# EAGLE design NanoV3.3 (EAGLE 9.2.2)
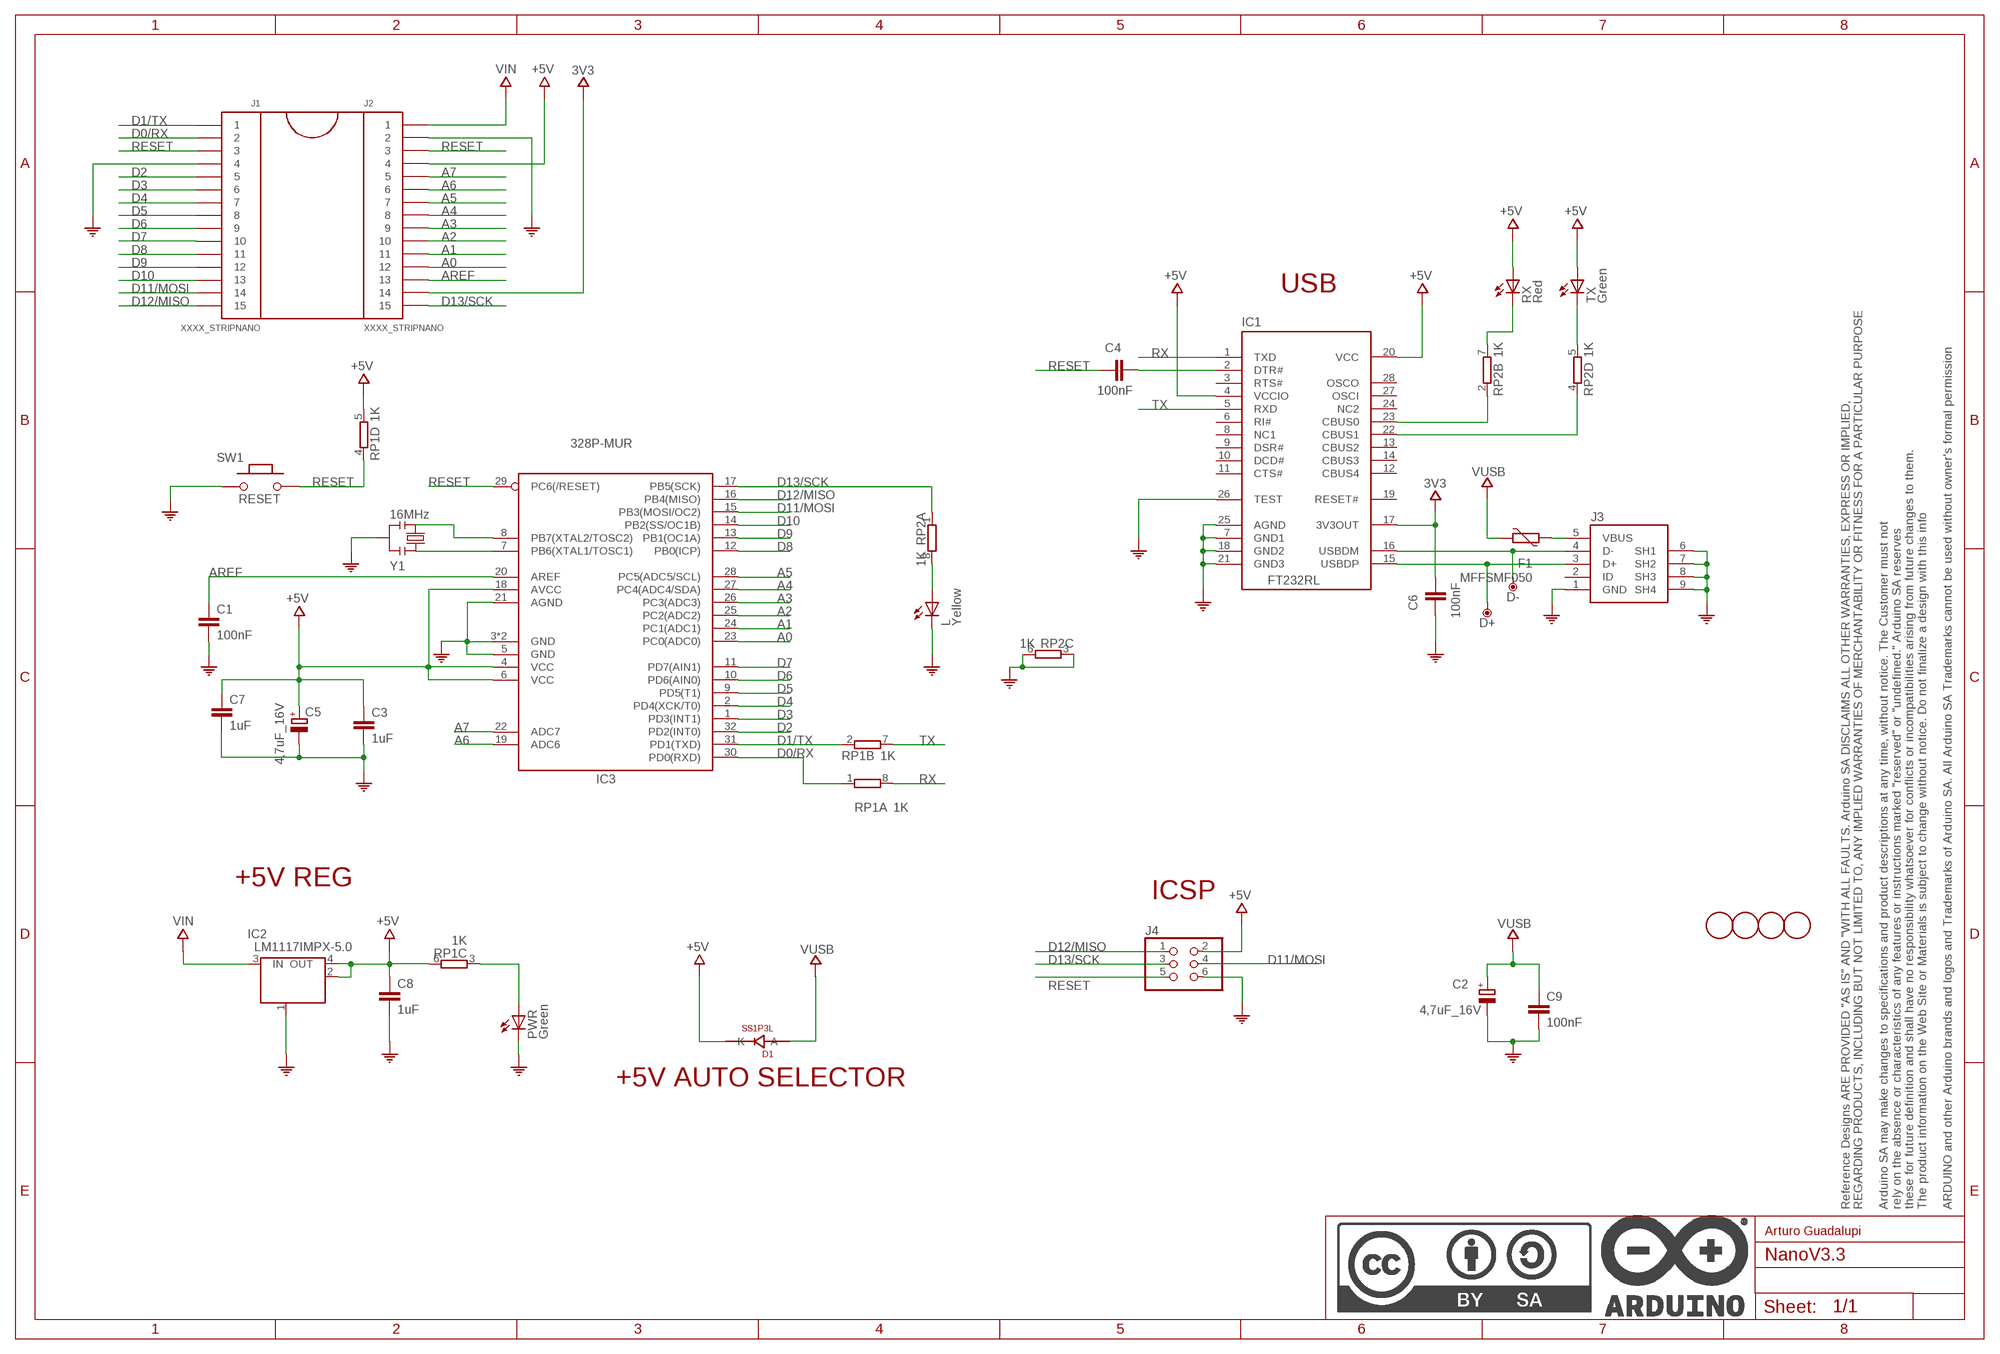
[diagram p0: schematic, sheet 1]

## Parts
C1  100nF  0015_100NF_0603  [C0603-ROUND]
C2  4,7uF_16V  0833_TAJA475MO16RNJ  [TAN-A]
C3  1uF  0006_1UF_0603/GRM188R61E105KA12D  [C0603-ROUND]
C4  100nF  0015_100NF_0603  [C0603-ROUND]
C5  4,7uF_16V  0833_TAJA475MO16RNJ  [TAN-A]
C6  100nF  0015_100NF_0603  [C0603-ROUND]
C7  1uF  0006_1UF_0603/GRM188R61E105KA12D  [C0603-ROUND]
C8  1uF  0006_1UF_0603/GRM188R61E105KA12D  [C0603-ROUND]
C9  100nF  0015_100NF_0603  [C0603-ROUND]
D1  SS1P3L  0025_SS1P3L-M3/84A  [DO220AAL]
D+  DNP  TPTP-1.00MM  [TP-1.00MM]
D-  DNP  TPTP-1.00MM  [TP-1.00MM]
F1  MFFSMF050  PTC  [0603-1608X90N]
FRAME1  DNP  A3-FRAME  [FRAME]
IC1  FT232RL  0226_FT232RL  [SSOP28]
IC2  LM1117IMPX-5.0  0022_LM1117IMPX-5.0  [LINEAR_SOT223]
IC3  328P-MUR  ATMEGA328P-32MUR  [VQFN32]
J1  XXXX_STRIPNANO  [HEAD15-NOSS]
J2  XXXX_STRIPNANO  [HEAD15-NOSS]
J3  0219_14850  [USB-MINI-B_2]
J4  0114_PH254-203DF118A00V  [2X03]
L  Yellow  0044_KPT-2012YC  [CHIPLED_0805]
PWR  Green  0043_KPT-2012SGC  [CHIPLED_0805]
RP1  1K  0005_064R_1K_/_CAY16-102J4LF  [CAY16]
RP2  1K  0005_064R_1K_/_CAY16-102J4LF  [CAY16]
RX  Red  0181_KTP-2012SURCK  [CHIPLED_0805]
SW1  RESET  0173_IT-1185AP1C-160G-G_T&R  [SMD_157SW]
TX  Green  0043_KPT-2012SGC  [CHIPLED_0805]
U$4  DNP  FIDUCIAL-1.5MM  [FD-1-1.5]
U$5  DNP  FIDUCIAL-1.5MM  [FD-1-1.5]
U$53  DNP  FIDUCIAL-1.5MM  [FD-1-1.5]
U$54  DNP  FIDUCIAL-1.5MM  [FD-1-1.5]
Y1  16MHz  0011_CSTCE16M0V53-R0  [RESONATOR]

## Nets
3V3: C6.2 IC1.17(3V3OUT) J2.14
+5V: C3.1 C5.1(+) C7.1 C8.1 D1.P$1(K) IC1.4(VCCIO) IC1.20(VCC) IC2.2(OUT) IC2.4(OUT) IC3.4(VCC) IC3.6(VCC) IC3.18(AVCC) J2.4 J4.2 RP1.5 RP1.6 RX.A TX.A
A0: IC3.23(PC0(ADC0)) J2.12
A1: IC3.24(PC1(ADC1)) J2.11
A2: IC3.25(PC2(ADC2)) J2.10
A3: IC3.26(PC3(ADC3)) J2.9
A4: IC3.27(PC4(ADC4/SDA)) J2.8
A5: IC3.28(PC5(ADC5/SCL)) J2.7
A6: IC3.19(ADC6) J2.6
A7: IC3.22(ADC7) J2.5
AREF: C1.1 IC3.20(AREF) J2.13
COM: C1.2 C2.2(-) C3.2 C5.2(-) C6.1 C7.2 C8.2 C9.2 IC1.7(GND1) IC1.18(GND2) IC1.21(GND3) IC1.25(AGND) IC1.26(TEST) IC2.1(GND/ADJ) IC3.3(GND) IC3.5(GND) IC3.21(AGND) IC3.33(GND) J1.4 J2.2 J3.1(GND) J3.6(SH1) J3.7(SH2) J3.8(SH3) J3.9(SH4) J4.6 L.C PWR.C RP2.3 RP2.6 SW1.1 Y1.2
D0/RX: IC3.30(PD0(RXD)) J1.2 RP1.1
D1/TX: IC3.31(PD1(TXD)) J1.1 RP1.2
D2: IC3.32(PD2(INT0)) J1.5
D3: IC3.1(PD3(INT1)) J1.6
D4: IC3.2(PD4(XCK/T0)) J1.7
D5: IC3.9(PD5(T1)) J1.8
D6: IC3.10(PD6(AIN0)) J1.9
D7: IC3.11(PD7(AIN1)) J1.10
D8: IC3.12(PB0(ICP)) J1.11
D9: IC3.13(PB1(OC1A)) J1.12
D10: IC3.14(PB2(SS/OC1B)) J1.13
D11/MOSI: IC3.15(PB3(MOSI/OC2)) J1.14 J4.4
D12/MISO: IC3.16(PB4(MISO)) J1.15 J4.1
D13/SCK: IC3.17(PB5(SCK)) J2.15 J4.3 RP2.1
N$1: IC3.8(PB7(XTAL2/TOSC2)) Y1.3
N$2: IC3.7(PB6(XTAL1/TOSC1)) Y1.1
N$3: PWR.A RP1.3
N$4: C4.2 IC1.2(DTR#)
N$5: D+.X IC1.15(USBDP) J3.3(D+)
N$6: D-.X IC1.16(USBDM) J3.4(D-)
N$7: L.A RP2.8
N$8: IC1.23(CBUS0) RP2.2
N$9: IC1.22(CBUS1) RP2.4
N$11: RP2.5 TX.C
N$26: F1.2 J3.5(VBUS)
N$29: RP2.7 RX.C
RESET: C4.1 IC3.29(PC6(/RESET)) J1.3 J2.3 J4.5 RP1.4 SW1.2
RX: IC1.1(TXD) RP1.8
TX: IC1.5(RXD) RP1.7
VIN: IC2.3(IN) J2.1
VUSB: C2.1(+) C9.1 D1.P$2(A) F1.1
Unconnected: IC1.3(RTS#) IC1.6(RI#) IC1.8(NC1) IC1.9(DSR#) IC1.10(DCD#) IC1.11(CTS#) IC1.12(CBUS4) IC1.13(CBUS2) IC1.14(CBUS3) IC1.19(RESET#) IC1.24(NC2) IC1.27(OSCI) IC1.28(OSCO) J3.2(ID)

## Notes on the sheet
- USB
- +5V REG
- ICSP
- +5V AUTO SELECTOR
- Arturo Guadalupi

## Library data of the parts
C1 C4 C6 C9 = Condensatori:0015_100NF_0603: 100nF 0603 50V; CASE: 0603; MONTHLY_USAGE: _____; PART_NUMBER: cl10b104kbnc; PRICE: _____; SUPPLIER: _____; TYPE: Condensatori
C2 C5 = Condensatori:0833_TAJA475MO16RNJ: 4,7uF; CASE: Case_A_(1206); MONTHLY_USAGE: _____; PART_NUMBER: TAJA475MO16RNJ; PRICE: _____; SUPPLIER: _____; TYPE: Condensatori
C3 C7 C8 = Condensatori:0006_1UF_0603/GRM188R61E105KA12D: 1uF 0603; CASE: 0603; MONTHLY_USAGE: _____; PART_NUMBER: 1uF_0603/GRM188R61E105KA12D; PRICE: _____; SUPPLIER: _____; TYPE: Condensatori
D1 = Diodi:0025_SS1P3L-M3/84A: 1A 30V Schottky Barrier Rectifiers -SS1P3L-M3/84A; CASE: SMP; MONTHLY_USAGE: _____; PART_NUMBER: SS1P3L-M3/84A; PRICE: _____; SUPPLIER: _____; TYPE: Diodi
D+ D- = Arduino-utility:TP: Testpoint; DATASHEET: DNP; DISTRIBUTOR-LINK: DNP; DISTRIBUTOR-PN: DNP; MANUFACTURER: DNP; MANUFACTURER-PN: DNP
F1 = Arduino-rcl:PTC: SMD PTC; DATASHEET: http://www.bourns.com/docs/Product-Datasheets/mffsmf.pdf; DISTRIBUTOR-LINK: http://www.digikey.com/product-detail/en/bourns-inc/MF-FSMF050X-2/MF-FSMF050X-2CT-ND/2039389; DISTRIBUTOR-PN: MF-FSMF050X-2CT-ND; MANUFACTURER: Bourns Inc; MANUFACTURER-PN: MF-FSMF050X-2
FRAME1 = Arduino-utility:A3-FRAME; CODE-ARDUINO: DNP; DATASHEET: DNP; DISTRIBUTOR-LINK: DNP; DISTRIBUTOR-PN: DNP; MANUFACTURER: DNP; MANUFACTURER-PN: DNP; NOTE: DNP
IC1 = IntegratedCircuits:0226_FT232RL: USB to serial UART interface -FT232RL; CASE: SSOP28; MONTHLY_USAGE: _____; PART_NUMBER: FT232RL; PRICE: _____; SUPPLIER: _____; TYPE: Circuito_Integrato
IC2 = IntegratedCircuits:0022_LM1117IMPX-5.0: Low-dropout linear regulator 5V -LM1117IMPX-5.0; CASE: SOT223; MONTHLY_USAGE: _____; PART_NUMBER: LM1117IMPX-5.0; PRICE: _____; SUPPLIER: _____; TYPE: Circuito_Integrato
IC3 = Arduino-ucs&SoCs:ATMEGA328P-32: 8-bit Microcontroller with 32KBytes In-System Programmable Flash ATMEGA328P-AU; DATASHEET: http://www.atmel.com/images/Atmel-8271-8-bit-AVR-Microcontroller-ATmega48A-48PA-88A-88PA-168A-168PA-328-328P_datasheet_Complete.pdf; DISTRIBUTOR-LINK: https://www.digikey.it/product-detail/it/microchip-technology/ATMEGA328P-MUR/ATMEGA328P-MURCT-ND/3440953; DISTRIBUTOR-PN: ATMEGA328P-MURCT-ND; MANUFACTURER: ATMEL; MANUFACTURER-PN: ATMEGA328P-MUR
J1 J2 = Connettori:XXXX_STRIPNANO: Strip passo 2,54 a 15 pin per Arduino Nano; VALUE: Strip15pin
J3 = Connettori:0219_14850: Usb-Mini F 90 Smd; MONTHLY_USAGE: _____; PART_NUMBER: 14850; PRICE: _____; SUPPLIER: _____; TYPE: Connettori; VALUE: USB-mini-90 -SMD
J4 = Connettori:0114_PH254-203DF118A00V: 3x2 M V h 8,5 mm p2,54; MONTHLY_USAGE: _____; PART_NUMBER: PH254-203DF118A00V; PRICE: _____; SUPPLIER: _____; TYPE: Connettori; VALUE: ICSP
L = Opto:0044_KPT-2012YC: LED YELLOW - SMD - 0805; MONTHLY_USAGE: _____; PART_NUMBER: KPT-2012YC; PRICE: _____; SUPPLIER: _____; TYPE: Opto
PWR TX = Opto:0043_KPT-2012SGC: LED GREEN - SMD-0805; MONTHLY_USAGE: _____; PART_NUMBER: KPT-2012SGC; PRICE: _____; SUPPLIER: _____; TYPE: Opto
RP1 RP2 = Resistenze:0005_064R_1K_/_CAY16-102J4LF: 1K 064R; CASE: SMD_3,2x1,6; MONTHLY_USAGE: _____; PART_NUMBER: 064R_1K_/_CAY16-102J4LF; PRICE: _____; SUPPLIER: _____; TYPE: Resistenze
RX = Opto:0181_KTP-2012SURCK: LED RED - SMD - 0805; MONTHLY_USAGE: _____; PART_NUMBER: KTP-2012SURCK; PRICE: _____; SUPPLIER: _____; TYPE: Opto
SW1 = Switches:0173_IT-1185AP1C-160G-G_T&R: Pushbutton 4x3 SMD H2,5mm; MONTHLY_USAGE: _____; PART_NUMBER: IT-1185AP1C-160G-G_T&R; PRICE: _____; SUPPLIER: _____; TYPE: Switches; VALUE: 157SW
U$4 U$5 U$53 U$54 = Arduino-utility:FIDUCIAL: Fiducial mount; DATASHEET: DNP; DISTRIBUTOR-LINK: DNP; DISTRIBUTOR-PN: DNP; MANUFACTURER: DNP; MANUFACTURER-PN: DNP
Y1 = Cristalli:0011_CSTCE16M0V53-R0: 16Mhz - SMD; MONTHLY_USAGE: _____; PART_NUMBER: CSTCE16M0V53-R0; PRICE: _____; SUPPLIER: _____; TYPE: Cristalli; VALUE: CSTCE16M0V53-R0

## Board
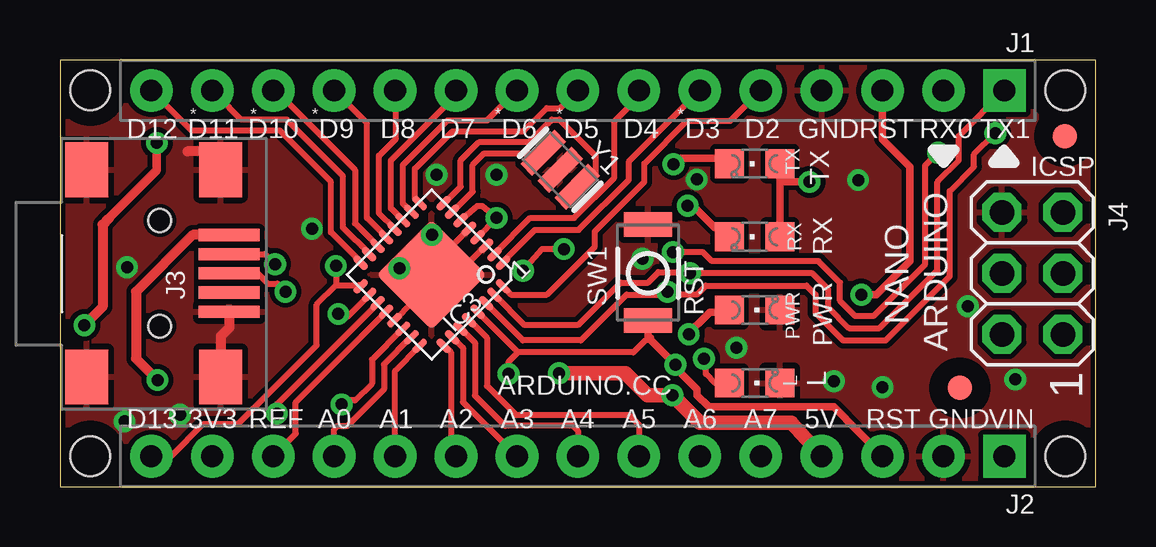
[diagram p1: board, top side]
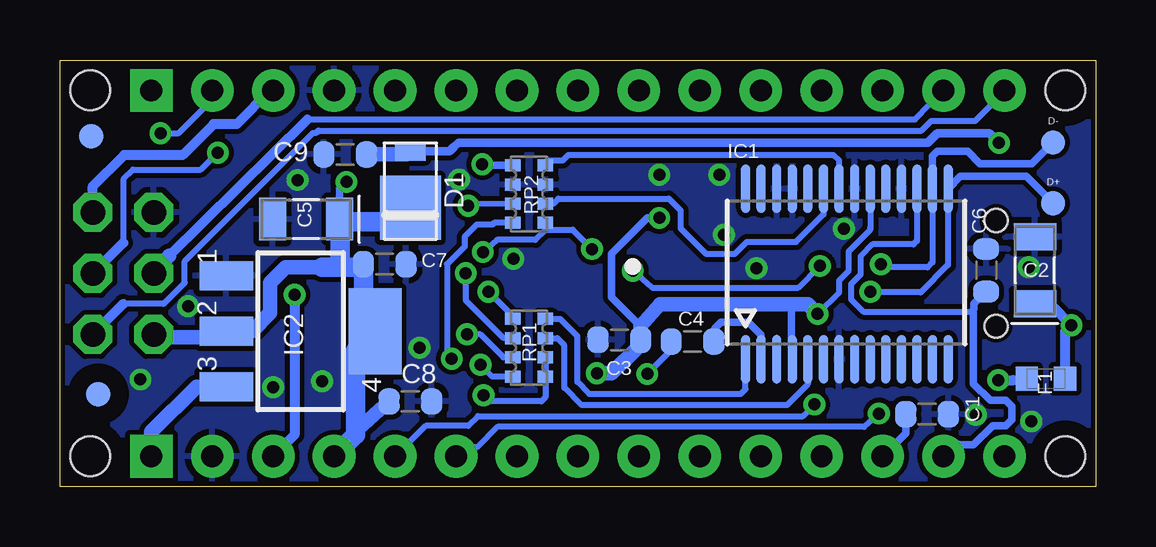
[diagram p2: board, bottom side, seen from below]

Size 43.18 x 17.78 mm. Coordinates in mm from the lower left corner, seen from the top.
Outline: 0,17.78 0,0 43.18,0 43.18,17.78 0,17.78
Copper layers (1*16): Top 0.035mm / dielectric 1.5mm / Bottom 0.035mm
Design rules "default *": minimum track width 10mil, minimum drill 16mil, track to track 8mil, track to pad 8mil, pad to pad 8mil, via to via 8mil, smd to smd 8mil, copper to edge 8mil, drill to drill 8mil, minimum pad ring 12mil, minimum via ring 8mil, stop-mask expansion 0mil, vias tented up to drill 24mil, thermal gap 10mil
Holes 1.65 mm at 1.27,16.51 1.27,1.27 41.91,1.27 41.91,16.51
tRestrict: area 0.1,15.4 to 2.4,17.7; area 40.8,0.1 to 43.1,2.4; area 0.1,0.1 to 2.4,2.4; area 40.8,15.4 to 43.1,17.7
bRestrict: area 0.1,0.1 to 2.4,2.4; area 0.1,15.4 to 2.4,17.7; area 40.8,15.4 to 43.1,17.7; area 40.8,0.1 to 43.1,2.4

### Footprints (pad centres in the part's own frame; a part is rotated, then mirrored left to right if it is on the bottom)
C0603-ROUND = smd 0.898 x 1.1: 1 -0.889,0; 2 0.889,0
TAN-A = smd 1.118 x 1.778: 1 0,0; 2 2.794,0
DO220AAL = smd 2.667 x 2.54: P$1 -0.7,0 | smd 0.762 x 1.27: P$2 1.65,0
TP-1.00MM = smd 1 x 1 bottom: X 0,0
0603-1608X90N = smd 0.95 x 1: 1 -0.8,0; 2 0.8,0
SSOP28 = smd 0.381 x 2.032: 1 0,0; 2 0.65,0; 3 1.3,0; 4 1.95,0; 5 2.6,0; 6 3.25,0; 7 3.9,0; 8 4.55,0; 9 5.2,0; 10 5.85,0; 11 6.5,0; 12 7.15,0; 13 7.8,0; 14 8.45,0; 15 8.45,7.112; 16 7.8,7.112; 17 7.15,7.112; 18 6.5,7.112; 19 5.85,7.112; 20 5.2,7.112; 21 4.55,7.112; 22 3.9,7.112; 23 3.25,7.112; 24 2.6,7.112; 25 1.95,7.112; 26 1.3,7.112; 27 0.65,7.112; 28 0,7.112
LINEAR_SOT223 = smd 1.219 x 2.235: 1 -2.311,-3.099; 2 0,-3.099; 3 2.311,-3.099 | smd 3.6 x 2.2: 4 0,3.099
VQFN32 = smd 0.7 x 0.28: 1 -2.45,1.75; 2 -2.45,1.25; 3 -2.45,0.75; 4 -2.45,0.25; 5 -2.45,-0.25; 6 -2.45,-0.75; 7 -2.45,-1.25; 8 -2.45,-1.75; 17 2.45,-1.75; 18 2.45,-1.25; 19 2.45,-0.75; 20 2.45,-0.25; 21 2.45,0.25; 22 2.45,0.75; 23 2.45,1.25; 24 2.45,1.75 | smd 0.28 x 0.7: 9 -1.75,-2.45; 10 -1.25,-2.45; 11 -0.75,-2.45; 12 -0.25,-2.45; 13 0.25,-2.45; 14 0.75,-2.45; 15 1.25,-2.45; 16 1.75,-2.45; 25 1.75,2.45; 26 1.25,2.45; 27 0.75,2.45; 28 0.25,2.45; 29 -0.25,2.45; 30 -0.75,2.45; 31 -1.25,2.45; 32 -1.75,2.45 | smd 3.254 x 3.254: 33 0,0
HEAD15-NOSS = drill 0.914 pad 1.778 square: 1 0,0 | drill 0.914 pad 1.778: 2 2.54,0; 3 5.08,0; 4 7.62,0; 5 10.16,0; 6 12.7,0; 7 15.24,0; 8 17.78,0; 9 20.32,0; 10 22.86,0; 11 25.4,0; 12 27.94,0; 13 30.48,0; 14 33.02,0; 15 35.56,0
USB-MINI-B_2 = smd 0.508 x 2.54: 1 0,0; 2 0.8,0; 3 1.6,0; 4 2.4,0; 5 3.2,0 | smd 2.286 x 1.778: 6 -2.717,5.948; 7 -2.717,0.36; 8 5.918,0.36; 9 5.918,5.948 | hole 0.95: -0.6,2.9; 3.8,2.9
2X03 = drill 1.016 pad 1.55 octagon: 1 -2.54,-1.27; 2 -2.54,1.27; 3 0,-1.27; 4 0,1.27; 5 2.54,-1.27; 6 2.54,1.27
CHIPLED_0805 = smd 1.2 x 1.2: A 0,-1.05; C 0,1.05
CAY16 = smd 0.5 x 0.65: 1 -1.2,-0.675; 2 -0.4,-0.675; 3 0.4,-0.675; 4 1.2,-0.675; 5 1.2,0.675; 6 0.4,0.675; 7 -0.4,0.675; 8 -1.2,0.675
SMD_157SW = smd 1.016 x 1.981: 1 0,0; 2 4,0
FD-1-1.5 = smd 1.016 x 1.016: P$1 0,0
RESONATOR = smd 0.7 x 2: 1 -1,0; 2 0,0; 3 1,0

### Placement (x,y rotation side)
C1  7.04,3.02 0 bottom
C2  2.54,7.62 90 bottom
C3  19.86,6.12 180 bottom
C4  16.81,6.05 0 bottom
C5  31.52,11.15 180 bottom
C6  4.57,9.02 270 bottom
C7  29.64,9.27 0 bottom
C8  28.57,3.56 0 bottom
C9  31.29,13.84 180 bottom
D1  28.57,12.32 90 bottom
D+  1.78,11.81 0 top
D-  1.78,14.35 0 top
F1  2.08,4.5 180 bottom
FRAME1  0,0 0 top
IC1  14.61,5.31 0 bottom
IC2  33.15,6.48 270 bottom
IC3  15.49,8.84 225 top
J1  39.37,16.51 180 top
J2  39.37,1.27 180 top
J3  7.06,7.29 90 top
J4  40.54,8.89 90 top
L  28.96,4.32 270 top
PWR  28.96,7.37 270 top
RP1  23.62,5.79 270 bottom
RP2  23.62,12.19 90 bottom
RX  28.96,10.41 90 top
SW1  24.51,10.92 270 top
TX  28.96,13.46 90 top
U$4  37.52,4.11 270 top
U$5  41.88,14.61 0 top
U$53  41.58,3.86 90 bottom
U$54  41.88,14.61 90 bottom
Y1  20.85,13.21 315 top

### Tracks (layer width: path | path; a pad name or v marks a point on that pad's centre or on a via)
3V3
  Bottom 0.254: IC1.17 7.46,10.24 7.6,10.1 9.31,10.1 9.31,10.09 9.8,9.6 9.8,8.85 10.2,8.45 10.2,7.8 9.7,7.3 5.18,7.3 5.08,7.4
  Bottom 0.305: 4.6,8.15 C6.2 5.08,7.62 5.08,7.4 | 5.71,1.78 5.84,1.78 J2.14 5.87,1.75 5.1,1.75 4.3,2.55 3.75,2.55 3.5,2.8 3.5,3.35 3.75,3.6 4.4,3.6 5.1,4.3 5.1,7.22 5.18,7.3
+5V  (via drill 0.5, 0.5 pad 0.91)
  Top 0.254: IC3.18 12.88,7.98 12,7.1 11.7,7.1 v11.6,7.2 | IC3.4 17.4,10.4 v18.2,11.2 17.6,11.7 17.4,11.7 IC3.6
  Top 0.305: TX.A 30.01,12.7 | 30.01,12.7 RX.A | v31.24,12.7 30.01,12.7
  Top 0.61: v20.8,4.72 23.57,4.72 24.49,3.81 v25.53,3.81 26.67,2.67 30.48,2.67 J2.4
  Bottom 0.254: 12.7,5.38 IC1.4 | v25.53,3.81 25.27,3.56 23.11,3.56 22.95,3.72 RP1.5 RP1.6 | 18.1,7.55 18.16,7.59 | IC1.20 9.4,10.71 | v11.6,7.2 10.7,8.1 10.7,8.6 10.3,9 10.3,9.81 9.4,10.71 | 9.4,10.71 9.4,10.8
  Bottom 0.305: 29.34,4.95 29.34,5.77 IC2.4 | C5.1 31.52,12.42 v31.24,12.7 | 12.7,5.38 12.7,7.39 12.6,7.59 | 18.97,6.68 20,7.71 20.01,7.71 20.2,7.9 20.2,9.7 18.7,11.2 v18.2,11.2
  Bottom 0.406: IC2.2 36.37,6.35 | 30.61,7.37 30.61,7.04 30.45,6.88 | 30.45,6.88 IC2.4 | 30.12,7.21 30.45,6.88 | 31.42,11.05 C5.1
  Bottom 0.61: 36.37,6.35 36.96,6.35 37.08,6.22 38.73,6.22 38.86,6.35 J4.2 | IC2.2 35.18,6.48 34.42,7.24 34.42,8.51 33.78,9.14 32.26,9.14 | D1.P$1 28.77,11.62 29.34,11.05 | C8.1 30.73,2.41 30.86,2.41 | 20.8,4.75 v20.8,4.72 20.19,4.72 19.07,5.84 C3.1 18.97,6.68 18.16,7.59 12.6,7.59 11.99,7.59 v11.6,7.2
  Bottom 0.813: IC2.4 30.86,5.66 30.86,2.41 30.86,2.16 J2.4 | 29.34,11.05 31.42,11.05 | 30.12,7.21 30.53,7.37 C7.1 30.66,9.14 31.5,9.14 | 32.26,9.14 31.5,9.14 | 31.5,9.14 31.5,11.12 C5.1
A0
  Top 0.254: J2.12 11.43,2.39 11.58,2.54 11.99,2.54 13.5,4.05 13.5,5.1 14.62,6.22 IC3.23
A1
  Top 0.254: J2.11 13.97,4.84 IC3.24
A2
  Top 0.254: IC3.25 16.03,5.87 16.3,5.6 16.3,1.48 J2.10
A3
  Top 0.254: IC3.26 16.38,6.22 16.8,5.8 16.8,3.52 J2.9
A4
  Top 0.254: J2.8 21.59,2.34 21.39,2.54 18.56,2.54 17.3,3.8 17.3,6 16.72,6.58 IC3.27
A5
  Top 0.254: J2.7 24.13,2.59 23.72,3 19,3 17.8,4.2 17.8,6.2 17.07,6.93 IC3.28
A6  (via drill 0.5 pad 0.81)
  Top 0.254: IC3.19 9.04,3.44 v9.04,3.05
  Bottom 0.254: J2.6 26.29,1.65 25.78,1.65 24.94,2.49 9.65,2.49 v9.04,3.05
A7  (via drill 0.5 pad 0.81)
  Top 0.254: 11.73,3.4 v11.73,3.43 11.91,3.6 12.3,3.6 13,4.3 13,5.3 14.28,6.58 IC3.22
  Bottom 0.254: J2.5 27.94,2.54 26.16,2.54 25.76,2.95 12.22,2.95 v11.73,3.43
AREF
  Top 0.254: J2.13 9.83,2.21 9.83,3.53 IC3.20
  Bottom 0.305: C1.1 7.92,2.24 J2.13
COM  (via drill 0.5, 0.5 pad 0.81, 0.5 pad 0.91)
  Top 0.254: IC3.5 16.1,9.8 | IC3.3 17.74,10.04 16.8,9.1 | IC3.21 14.7,7.7 14.7,8.04 | 14.7,8.04 IC3.33 16.1,9.45 16.1,9.8 | 16.1,9.8 15.7,9.8 v15.5,10.5 | 14.7,8.04 14.7,8.55 v14.15,9.1
  Top 0.305: 16.8,9.1 16.4,9.1 v15.5,10.5
  Top 0.406: J3.1 7.06,6.63 6.71,6.27 J3.7 | J3.8 6.7,13.97 5.31,13.97
  other vias: 39.83,4.47 33.27,12.78 26.54,12.8 28.19,5.79 32.26,4.39 34.29,4.14 37.85,7.52 24.28,9.5 2.69,2.72 2.79,9.14 15.7,13 18.2,13 10.5,10.75 5,3
  pour Top (isolate 0.203): 0.25,17.53 46.23,17.65 46.23,0.38 0.25,0.25
  pour Bottom (isolate 0.203): 0.25,17.53 44.83,17.65 44.83,0.38 0.25,0.25
D0/RX  (via drill 0.5, 0.5 pad 0.81)
  Top 0.254: v25.32,8.13 25.07,8 23.62,8 21.72,6.1 21.71,6.1 19.3,6.1 IC3.30 | v38.99,14.73 38.1,13.84 38.1,13.34 37.08,12.32 37.08,8.76 34.42,6.1 32.64,6.1 31.5,7.24 31.5,8 31.11,8.38 26.92,8.38 26.54,8 25.45,8 v25.32,8.13 | 25.4,8.13 v25.32,8.13
  Bottom 0.254: J1.2 36.83,16.13 38.23,14.73 v38.99,14.73 | RP1.1 24.3,7.1 v25.32,8.13
D1/TX  (via drill 0.5)
  Top 0.254: J1.1 37.47,14.61 37.47,13.59 36.58,12.7 36.58,9.02 34.16,6.6 32.89,6.6 32,7.49 32,8.26 31.37,8.89 v26.26,8.89 26.21,8.94 24.94,8.94 24.51,8.51 23.37,8.51 21.59,6.73 19.37,6.73 IC3.31
  Bottom 0.254: RP1.2 24.68,6.19 26.26,7.77 v26.26,8.89
D2
  Top 0.254: J1.5 27.94,15.24 26.14,15.24 24.36,13.46 24.36,12.7 22.3,10.64 22.3,10 20.3,8 18.8,8 IC3.32
D3
  Top 0.254: J1.6 23.7,13.54 23.7,12.8 23.71,12.79 21.62,10.7 19.8,10.7 18.46,9.36 IC3.1
D4
  Top 0.254: J1.7 24.13,16.26 23.09,15.21 23.09,12.85 21.44,11.2 19.6,11.2 18.11,9.71 IC3.2
D5
  Top 0.254: J1.8 20.85,15.77 20.3,15.77 19.33,14.81 16.36,14.81 14.8,13.25 14.8,12 IC3.9
D6
  Top 0.254: J1.9 17.8,15.27 16.15,15.27 14.3,13.41 14.3,11.8 IC3.10 | IC3.10
D7
  Top 0.254: IC3.11 13.8,11.6 13.8,13.6 16.51,16.31 J1.10
D8
  Top 0.254: IC3.12 13.94,10.76 13.3,11.4 13.3,13.8 14,14.5 14,16.48 J1.11
D9
  Top 0.254: IC3.13 13.59,10.41 12.8,11.2 12.8,15.14 J1.12
D10
  Top 0.254: 13.23,10.07 IC3.14 12.3,10.97 12.3,13.2 8.99,16.51 J1.13
D11/MOSI
  Top 0.254: J1.14 7.07,15.79 7.07,15.78 7.55,15.29 9.45,15.29 11.8,12.94 11.8,10.8 12.88,9.72 IC3.15
  Bottom 0.254: 32.87,15.29 7.54,15.29 J1.14
  Bottom 0.406: 38.63,9.63 32.87,15.29
  Bottom 0.61: J4.4 38.63,9.63
D12/MISO
  Top 0.254: J1.15 5.49,14.83 9.17,14.83 11.3,12.7 11.3,10.6 12.52,9.38 IC3.16
  Bottom 0.254: 40.54,7.62 38.86,7.62 37.97,8.51 37.97,9.4 32.64,14.73 32.51,14.73 32.41,14.83 7.26,14.83 6.86,15.24 5.03,15.24 3.81,16.46 J1.15
  Bottom 0.406: 40.54,7.62 J4.1
D13/SCK  (via drill 0.5, 0.5 pad 0.81, 0.5 pad 0.91)
  Top 0.254: v25.55,9.78 26.8,9.78 27.18,9.4 31.62,9.4 32.51,8.51 32.51,7.75 33.15,7.11 33.91,7.11 36.07,9.27 36.07,13.39 v36.6,13.92 | 11.5,8.4 10.7,7.6 10.7,5.9 7.4,2.6 5.95,2.6 4.65,1.3 3.84,1.3 J2.15 | 11.5,8.4 12.47,8.4 IC3.17 | v21,9.9 20.1,9.9 v19.3,9 | v11.5,9.2 11.5,8.4
  Bottom 0.254: 40.54,10.16 40.54,12.8 40.13,13.21 37.31,13.21 v36.6,13.92 | RP2.1 22.95,10.71 | 22.95,10.71 23.37,10.29 24.97,10.29 v25.55,9.78 | 22.95,10.71 21.81,10.71 v21,9.9 | v19.3,9 18.5,8.3 12.4,8.3 v11.5,9.2
  Bottom 0.406: 40.54,10.16 J4.3
N$1
  Top 0.254: Y1.3 21.54,12.24 22.33,13.03 22.33,13.79 20.82,15.3 20.5,15.3 20.34,15.14 19.56,14.35 17.45,14.35 16.7,13.6 16.7,12.5 16.01,11.81 IC3.8
N$2
  Top 0.254: Y1.1 19.89,13.89 17.68,13.89 17.2,13.41 17.2,12.3 16.36,11.46 IC3.7
N$3  (via drill 0.5)
  Top 0.305: PWR.A 27.65,7.27 27.09,7.27 26.04,6.22 26.16,6.3 v26.21,6.35
  Bottom 0.254: v26.21,6.35 25.65,6.35 24.7,5.39 RP1.3
N$4
  Bottom 0.305: C4.2 15.88,6.1 15.88,6.6 15.62,6.86 14.48,6.86 13.96,6.33 IC1.2
N$5  (via drill 0.5 pad 0.81)
  Top 0.254: J3.3 8.23,8.89 8.66,8.46 9.07,8.46 v9.4,8.13 | J3.3
  Bottom 0.254: 6.15,12.45 6.16,12.43 6.16,12.32 6.16,9.24 7.3,8.1 9.37,8.1 v9.4,8.13
  Bottom 0.305: D+.X 2.9,12.93 5.65,12.93 IC1.15
  Bottom 0.356: IC1.15 6.16,12.32
N$6  (via drill 0.5 pad 0.81)
  Top 0.254: J3.4 8.55,9.69 v8.97,9.27
  Bottom 0.254: 6.79,12.45 6.81,12.43 6.81,9.35 7.01,9.14 8.84,9.14 v8.97,9.27
  Bottom 0.305: IC1.16 6.8,13.77 6.6,13.97 5.33,13.97 4.83,13.46 2.67,13.46 D-.X
  Bottom 0.356: IC1.16 6.81,12.43
N$7  (via drill 0.5 pad 0.81)
  Top 0.254: 27.92,4.32 27.3,4.32 26.92,4.7 26.95,5.08 v26.85,5.33
  Top 0.305: L.A 28.04,4.2 27.92,4.32
  Bottom 0.254: v26.85,5.33 27.05,5.61 27.05,9.27 26.31,10.01 26.31,10.41 25.81,10.92 25.15,10.92 25.08,10.99 RP2.8
N$8
  Bottom 0.254: RP2.2 22.93,11.81 22.59,11.81 22.4,12 17.8,12 17.3,11.5 17.3,10.75 16.25,9.7 15.05,9.7 14.55,10.2 12.5,10.2 11.35,11.35 IC1.23
  Bottom 0.305: IC1.23
N$9
  Bottom 0.254: IC1.22 10.71,13.6 10.95,13.82 22,13.82 22,13.81 22.23,13.59 22.88,13.59 RP2.4
N$11  (via drill 0.5 pad 0.81)
  Top 0.305: TX.C 27.88,13.69 25.88,13.69 25.78,13.59 v25.58,13.44
  Bottom 0.305: RP2.5 25.53,13.39 v25.58,13.44
N$26  (via drill 0.5)
  Top 0.406: J3.5 5.54,10.49 3.17,8.13 3.17,5.33 v4.06,4.45
  Bottom 0.406: v4.06,4.45 3.44,4.45 F1.2
N$29  (via drill 0.5)
  Top 0.305: RX.C 27.69,10.79 27.3,10.79 26.42,11.68 v26.16,11.71
  Bottom 0.254: RP2.7 26.04,11.78 v26.16,11.71
RESET  (via drill 0.5, 0.5 pad 0.91)
  Top 0.254: 19.09,5.6 23.9,5.6 24.4,6.1 24.64,6.1 24.64,6.22 24.51,6.22 | 17.42,7.28 IC3.29 19.09,5.6 | v18.7,4.7 18.7,5.21 19.09,5.6
  Top 0.305: J2.3 32.26,3.33 27.05,3.33 26.54,3.81 26.54,4.06 25.65,4.95 v25.65,5.08 24.64,6.1 | J1.3 34.29,14.48 35.43,13.34 35.43,9.4 34.04,8 v33.4,8 | 24.77,6.67 SW1.2 | 25.27,6.99 25.21,6.92 SW1.2 | 24.51,6.22 SW1.2
  Bottom 0.254: J1.3 34.42,16.51 | RP1.4 25.16,4.59 v25.65,5.08 | C4.1 | 17.7,5.7 v18.7,4.7
  Bottom 0.305: C4.1 17.7,5.77 | C4.1 17.7,5.7
  Bottom 0.406: v33.4,8 33.4,2.16 J2.3 | 34.42,16.51 35.81,15.11 36.78,15.11 38.08,13.82 40.51,13.82 41.81,12.52 J4.5
RX
  Bottom 0.254: IC1.1 14.61,4.06 14.81,3.86 21.11,3.86 21.61,4.37 21.61,6.27 22.33,6.99 RP1.8
TX
  Bottom 0.254: IC1.5 12.01,4.28 12.88,3.4 21.44,3.4 22.15,4.12 22.15,5.89 22.45,6.19 RP1.7
VIN
  Bottom 0.61: IC2.3 37.49,4.17 39.37,2.29 J2.1
VUSB  (via drill 0.5)
  Top 0.356: v4.04,14.33 4.04,13.18 2.03,11.18
  Top 0.406: 2.03,11.18 1.78,10.92 1.78,7.49 v1.02,6.73
  Bottom 0.356: v4.04,14.33 4.45,14.73 6.6,14.73 7.01,14.33 26.57,14.33 26.75,14.17 26.95,13.97 D1.P$2
  Bottom 0.406: 28.83,13.84 D1.P$2 | C2.1 1.91,7.62 v1.02,6.73 1.28,6.46 F1.1
  Bottom 0.61: D1.P$2 28.7,13.84 C9.1

### Text on the board
tPlace: D12 | D11 | * | D10 | * | * | D9 | D8 | D7 | * | D6 | * | D5 | D4 | * | D3 | D2 | GND | RST | RX0 | TX1 | TX | ICSP | ARDUINO | RX | NANO | RST | PWR | L | 1 | ARDUINO.CC | D13 | 3V3 | REF | A0 | A1 | A2 | A3 | A4 | A5 | A6 | A7 | 5V | RST | GND | VIN
test-probe: NANO / TEST POINTS | 10 | 9 | 8 | 7 | 6 | 5 | 4 | 3 | 2 | GND1 | RESET | 0 | 1 | USB_D- | USB_D+ | USB_GND | ISP1_5 | ISP1_4 | ISP1_3 | USB_5V | ISP1_1 | 3V3 | AREF | A0 | A1 | A2 | A3 | A4 | A5 | A6 | A7 | 5V_REF | DC_VIN- | DC_VIN+